# Altium schematic sheet ATECC.SchDoc
size A4; SheetNumber: 1; SheetTotal: 1
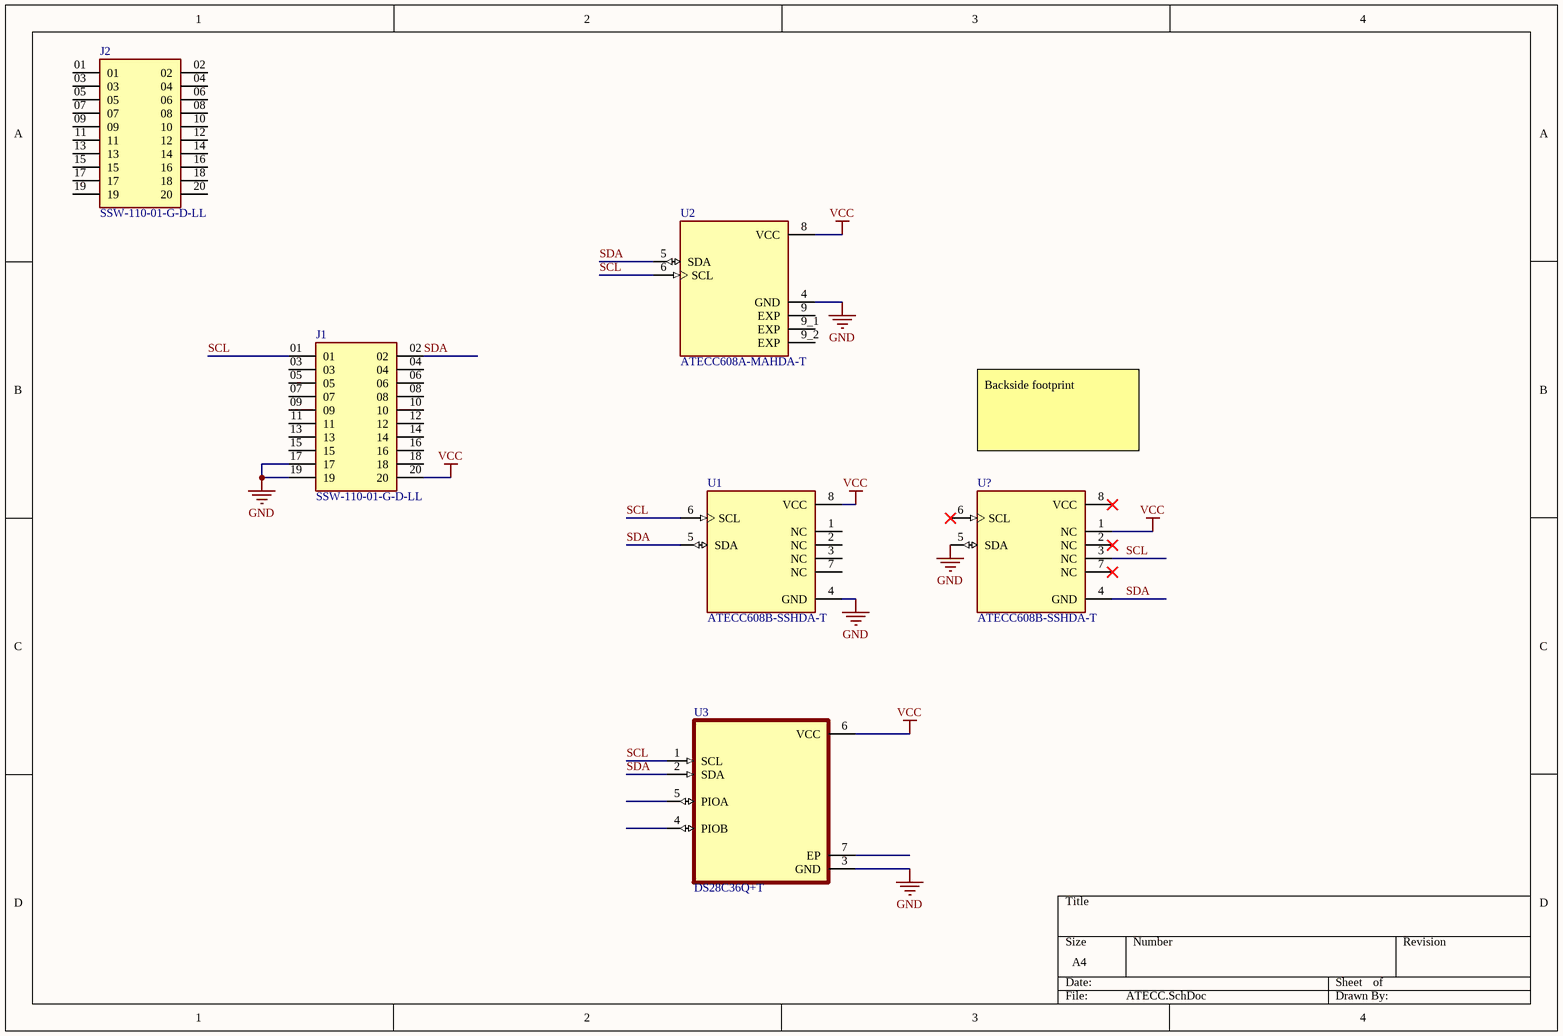
[diagram p0: ATECC.SchDoc]

## Parts
J1  SSW-110-01-G-D-LL  [SAMTEC_SSW-110-01-G-D-LL]
J2  SSW-110-01-G-D-LL  [SAMTEC_SSW-110-01-G-D-LL]
U1  ATECC608B-SSHDA-T  [SOIC127P600X175-8N]
U2  ATECC608A-MAHDA-T  [SON50P200X300X60-9N]
U3  DS28C36Q+T  [SON95P300X300X80-7N]
U?  ATECC608B-SSHDA-T  [SOIC127P600X175-8N]

## Nets
GND: J1.17 J1.19 U1.4(GND) U2.4(GND) U3.3(GND) U?.5(SDA)
VCC: J1.20 U1.8(VCC) U2.8(VCC) U3.6(VCC) U?.1(NC)
SCL: J1.01 U1.6(SCL) U2.6(SCL) U3.1(SCL) U?.3(NC)
SDA: J1.02 U1.5(SDA) U2.5(SDA) U3.2(SDA) U?.4(GND)

Not connected (* = marked no-connect by the designer): J1 03 04 05 06 07 08 09 10 11 12 13 14 15 16 18; J2 01 02 03 04 05 06 07 08 09 10 11 12 13 14 15 16 17 18 19 20; U1 1(NC) 2(NC) 3(NC) 7(NC); U2 9(EXP) 9_1(EXP) 9_2(EXP); U3 4(PIOB) 5(PIOA) 7(EP); U? 2(NC)* 6(SCL)* 7(NC)* 8(VCC)*

## Notes on the sheet
- Backside footprint

## Library data of the parts
J1 J2 = SSW-110-01-G-D-LL: MF: Samtec Inc.; Value: *; Availability: Unavailable; Package: None; Price: None; MP: SSW-110-01-G-D-LL
U1 U? = ATECC608B-SSHDA-T: Security ICs / Authentication ICs ECC/ECDH, I2C, SOIC T/R; MF: Microchip Technology; Availability: In Stock; Check_prices: https://www.snapeda.com/parts/ATECC608B-SSHDA-T/Microchip/view-part/?ref=eda; Price: None; SnapEDA_Link: https://www.snapeda.com/parts/ATECC608B-SSHDA-T/Microchip/view-part/?ref=snap; MP: ATECC608B-SSHDA-T; Value: *; Purchase-URL: https://pricing.snapeda.com/search/part/ATECC608B-SSHDA-T/?ref=eda; Package: SO-8 Microchip
U2 = ATECC608A-MAHDA-T: Authentication Chip 8-UDFN _2x3_; MF: Microchip Technology; SnapEDA_Link: https://www.snapeda.com/parts/ATECC608A-MAHDA-T/Microchip/view-part/3076417/?ref=snap; Value: *; Digi-Key_Part_Number: ATECC608A-MAHDA-TCT-ND; Digi-Key_Purchase_URL: https://www.digikey.com/product-detail/en/microchip-technology/ATECC608A-MAHDA-T/ATECC608A-MAHDA-TCT-ND/7928236?utm_source=snapeda&utm_medium=aggregator&utm_campaign=symbol; MP: ATECC608A-MAHDA-T; Package: UDFN-8 Microchip Technology
U3 = DS28C36Q+T: Package: None; Price: None; Value: *; MP: DS28C36Q+T; Availability: Unavailable